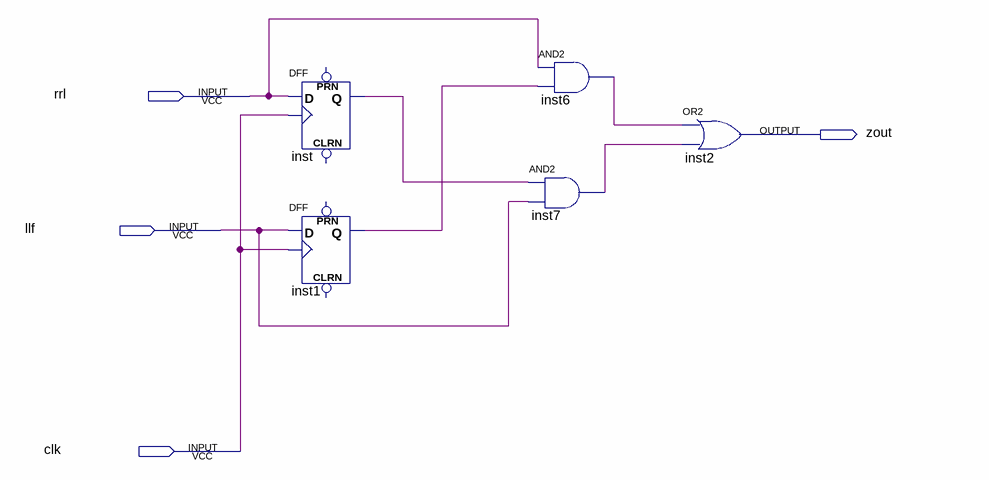
[diagram p0: schematic sheet]
// Quartus schematic lrchange1bit.bdf as structural Verilog: 5 symbols, 4 pins
module lrchange1bit (
  input  rrl,
  input  llf,
  input  clk,
  output zout
);

  wire inst1_q, inst6_out, inst7_out, inst_q;

  DFF inst (.CLK(clk), .D(rrl), .Q(inst_q));  // open: CLRN, PRN
  DFF inst1 (.CLK(clk), .D(llf), .Q(inst1_q));  // open: CLRN, PRN
  and inst6 (inst6_out, rrl, inst1_q);
  and inst7 (inst7_out, inst_q, llf);
  or inst2 (zout, inst6_out, inst7_out);
endmodule
